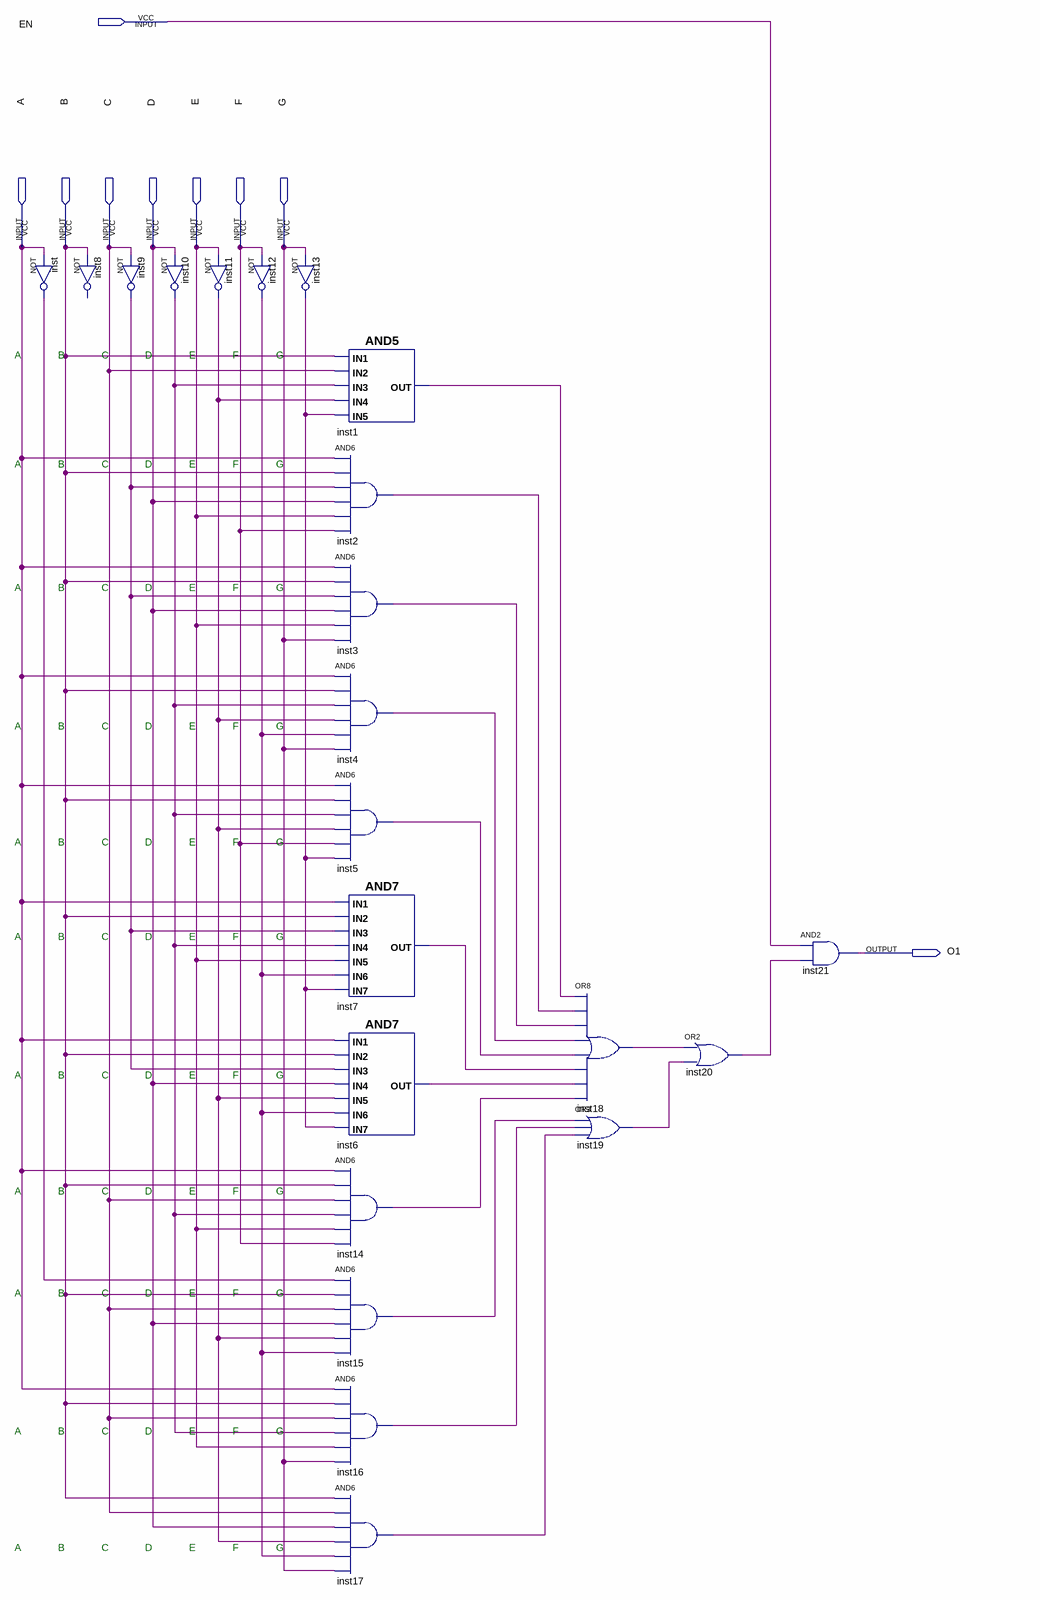
[diagram p0: schematic sheet]
// Quartus schematic linha3led5.bdf as structural Verilog: 22 symbols, 9 pins
module linha3led5 (
  input  EN,
  input  A,
  input  B,
  input  C,
  input  D,
  input  E,
  input  F,
  input  G,
  output O1
);

  wire inst1_out, inst2_out, inst3_out, inst4_out, inst5_out, inst6_out, inst7_out, inst9_out, inst10_out,
       inst11_out, inst12_out, inst13_out, inst14_out, inst15_out, inst16_out, inst17_out, inst18_out,
       inst19_out, inst20_out, inst_out;

  not inst (inst_out, A);
  // NOT inst8 has open pins: IN=B, OUT=open
  not inst9 (inst9_out, C);
  not inst10 (inst10_out, D);
  not inst11 (inst11_out, E);
  not inst12 (inst12_out, F);
  not inst13 (inst13_out, G);
  and inst1 (inst1_out, B, C, inst10_out, inst11_out, inst13_out);
  and inst2 (inst2_out, A, B, inst9_out, D, E, F);
  and inst3 (inst3_out, A, B, inst9_out, D, E, G);
  and inst4 (inst4_out, A, B, inst10_out, inst11_out, inst12_out, G);
  and inst5 (inst5_out, A, B, inst10_out, inst11_out, F, inst13_out);
  and inst7 (inst7_out, A, B, inst9_out, inst10_out, E, inst12_out, inst13_out);
  and inst6 (inst6_out, A, B, inst9_out, D, inst11_out, inst12_out, inst13_out);
  and inst14 (inst14_out, A, B, C, inst10_out, E, F);
  and inst15 (inst15_out, inst_out, B, C, D, inst11_out, inst12_out);
  and inst16 (inst16_out, A, B, C, inst10_out, E, G);
  and inst17 (inst17_out, B, C, D, inst11_out, inst12_out, G);
  or inst18 (inst18_out, inst1_out, inst2_out, inst3_out, inst4_out, inst5_out, inst7_out, inst6_out, inst14_out);
  or inst19 (inst19_out, inst15_out, inst16_out, inst17_out);
  or inst20 (inst20_out, inst18_out, inst19_out);
  and inst21 (O1, EN, inst20_out);

  // Notes on the sheet:
  //   A
  //   B
  //   C
  //   D
  //   E
  //   F
  //   G
  //   A
  //   B
  //   C
  //   D
  //   E
  //   F
  //   G
  //   A
  //   B
  //   C
  //   D
  //   E
  //   F
  //   G
  //   A
  //   B
  //   C
  //   D
  //   E
  //   F
  //   G
  //   A
  //   B
  //   C
  //   D
  //   E
  //   F
  //   G
  //   A
  //   B
  //   C
  //   D
  //   E
  //   F
  //   G
  //   A
  //   B
  //   C
  //   D
  //   E
  //   F
  //   G
  //   A
  //   B
  //   C
  //   D
  //   E
  //   F
  //   G
  //   A
  //   B
  //   C
  //   D
  //   E
  //   F
  //   G
  //   A
  //   B
  //   C
  //   D
  //   E
  //   F
  //   G
  //   A
  //   B
  //   C
  //   D
  //   E
  //   F
  //   G
endmodule
